# EAGLE schematic USB.BusinessCard (EAGLE 7.6.0)
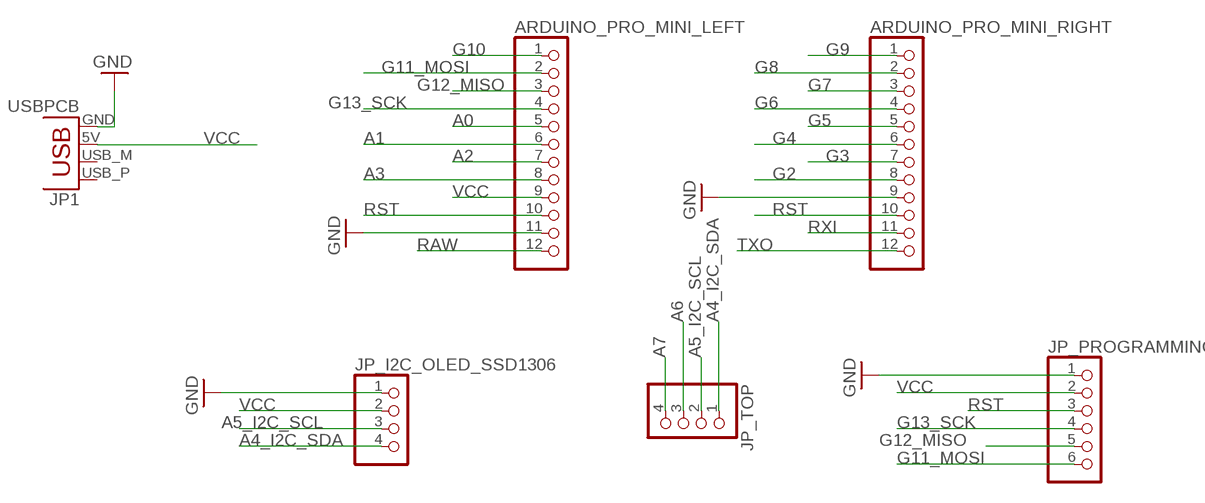
[diagram p0: schematic, sheet 1]

## Parts
ARDUINO_PRO_MINI_LEFT  PINHD-1X12  [1X12]
ARDUINO_PRO_MINI_RIGHT  PINHD-1X12  [1X12]
JP1  USBPCB  [USB-A-PCB]
JP_I2C_OLED_SSD1306  PINHD-1X4  [1X04]
JP_PROGRAMMING  PINHD-1X6  [1X06]
JP_TOP  PINHD-1X4  [1X04]

## Nets
A0: ARDUINO_PRO_MINI_LEFT.5
A1: ARDUINO_PRO_MINI_LEFT.6
A2: ARDUINO_PRO_MINI_LEFT.7
A3: ARDUINO_PRO_MINI_LEFT.8
A4_I2C_SDA: JP_I2C_OLED_SSD1306.4 JP_TOP.1
A5_I2C_SCL: JP_I2C_OLED_SSD1306.3 JP_TOP.2
A6: JP_TOP.3
A7: JP_TOP.4
G2: ARDUINO_PRO_MINI_RIGHT.8
G3: ARDUINO_PRO_MINI_RIGHT.7
G4: ARDUINO_PRO_MINI_RIGHT.6
G5: ARDUINO_PRO_MINI_RIGHT.5
G6: ARDUINO_PRO_MINI_RIGHT.4
G7: ARDUINO_PRO_MINI_RIGHT.3
G8: ARDUINO_PRO_MINI_RIGHT.2
G9: ARDUINO_PRO_MINI_RIGHT.1
G10: ARDUINO_PRO_MINI_LEFT.1
G11_MOSI: ARDUINO_PRO_MINI_LEFT.2 JP_PROGRAMMING.6
G12_MISO: ARDUINO_PRO_MINI_LEFT.3 JP_PROGRAMMING.5
G13_SCK: ARDUINO_PRO_MINI_LEFT.4 JP_PROGRAMMING.4
GND: ARDUINO_PRO_MINI_LEFT.11 ARDUINO_PRO_MINI_RIGHT.9 JP1.GND JP_I2C_OLED_SSD1306.1 JP_PROGRAMMING.1
RAW: ARDUINO_PRO_MINI_LEFT.12
RST: ARDUINO_PRO_MINI_LEFT.10 ARDUINO_PRO_MINI_RIGHT.10 JP_PROGRAMMING.3
RXI: ARDUINO_PRO_MINI_RIGHT.11
TXO: ARDUINO_PRO_MINI_RIGHT.12
VCC: ARDUINO_PRO_MINI_LEFT.9 JP1.5V(VBUS) JP_I2C_OLED_SSD1306.2 JP_PROGRAMMING.2
Unconnected: JP1.USB_M(D-) JP1.USB_P(D+)

## Library data of the parts
ARDUINO_PRO_MINI_LEFT ARDUINO_PRO_MINI_RIGHT = adafruit:PINHD-1X12: PIN HEADER
JP1 = SparkFun-Connectors:USB: USB Connectors USB-B-PTH is fully proven SKU : PRT-00139/CONN-08278 USB-miniB is fully proven SKU : PRT-00587 USB-A-PCB is untested. USB-A-H is throughly reviewed, but untested. Spark Fun Electronics SKU : PRT-00437 USB-B-SMT is throughly reviewed, but untested. Needs silkscreen touching up. USB-A-S has not been used/tested USB-MB-H has not been used/tested USB-MICROB has been used. CONN-09505
JP_I2C_OLED_SSD1306 JP_TOP = pinhead:PINHD-1X4: PIN HEADER
JP_PROGRAMMING = adafruit:PINHD-1X6: PIN HEADER